# EAGLE design telemetry-board (EAGLE 8.5.0)

## Sheet 1 of 2
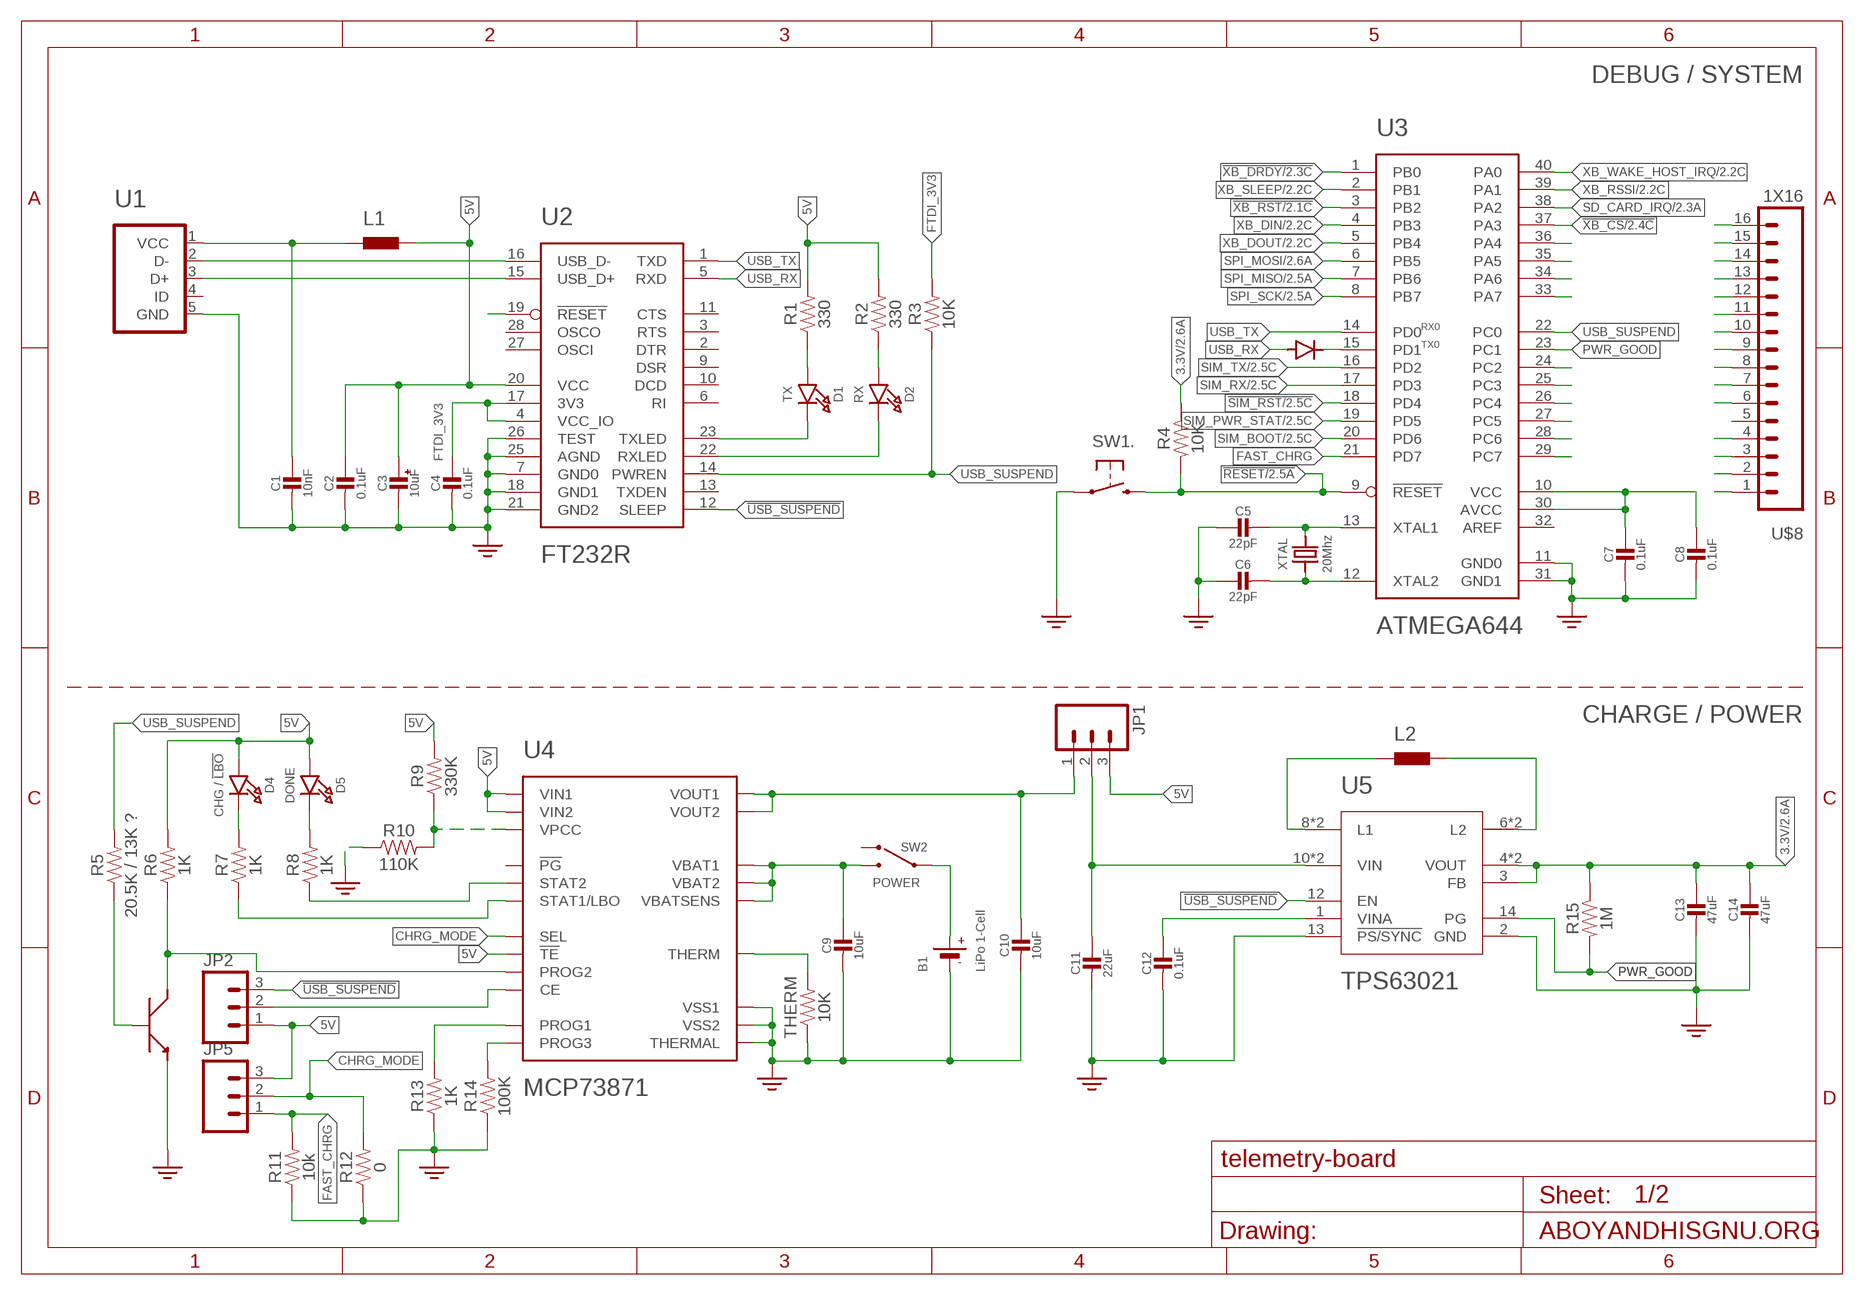
[diagram p0: schematic, sheet 1]
U$1 (FRAME_A4): AUTHOR: Harlan J. Waldrop

### Parts
B1  LiPo 1-Cell  BATTERY  [JSTPH2]
C1  10nF  CAPACITOR  [0805]
C2  0.1uF  CAPACITOR  [0805]
C3  10uF  CAPACITOR-POLAR  [0805]
C4  0.1uF  CAPACITOR  [0805]
C5  22pF  CAPACITOR  [0805]
C6  22pF  CAPACITOR  [0805]
C7  0.1uF  CAPACITOR  [0805]
C8  0.1uF  CAPACITOR  [0805]
C9  10uF  CAPACITOR  [0805]
C10  10uF  CAPACITOR  [0805]
C11  22uF  CAPACITOR  [0805]
C12  0.1uF  CAPACITOR  [0805]
C13  47uF  CAPACITOR  [0805]
C14  47uF  CAPACITOR  [0805]
D1  TX  LED0805_NOOUTLINE  [CHIPLED_0805_NOOUTLINE]
D2  RX  LED0805_NOOUTLINE  [CHIPLED_0805_NOOUTLINE]
D3  DIODE  [DB2J309]
D4  CHG / !LBO  LED0805_NOOUTLINE  [CHIPLED_0805_NOOUTLINE]
D5  DONE  LED0805_NOOUTLINE  [CHIPLED_0805_NOOUTLINE]
JP1  M03PTH  [1X03]
JP2  M03PTH  [1X03]
JP5  M03PTH  [1X03]
L1  INDUCTOR  [0805]
L2  INDUCTOR-744062001  [2727]
R1  330  RESISTOR  [0805]
R2  330  RESISTOR  [0805]
R3  10K  RESISTOR  [0805]
R4  10K  RESISTOR  [0805]
R5  20.5K / 13K ?  RESISTOR  [0805]
R6  1K  RESISTOR  [0805]
R7  1K  RESISTOR  [0805]
R8  1K  RESISTOR  [0805]
R9  330K  RESISTOR  [0805]
R10  110K  RESISTOR  [0805]
R11  10k  RESISTOR  [0805]
R12  0  RESISTOR  [0805]
R13  1K  RESISTOR  [0805]
R14  100K  RESISTOR  [0805]
R15  1M  RESISTOR  [0805]
SW1  SWITCH-B3U-1110-BOSS  [SWITCH-TACT-B3U-1100P-B]
SW2  POWER  SWITCH  [1101M2S4AQE2]
THERM  10K  RESISTOR  [0805]
U1  USB-RECEPTACLE  [USB-MICRO-B]
U2  FT232R  [SSOP-28]
U3  ATMEGA644  [DIP-2X20]
U4  MCP73871  [QFN20_4MM]
U5  TPS63021  [VSON-14-4X3]
U$2  TRANSISTOR  [SOT-223]
U$8  1X16  [1X16]
XTAL  20Mhz  CRYSTAL  [ABM3]

### Nets
3.3V: C7.1 C8.1 C13.1 C14.1 R4.1 R15.1 U3.10(VCC) U3.30(AVCC) U5.3(FB) U5.4(VOUT) U5.5(VOUT) U$8.7 ; also sheet 2
5V: C2.1 C3.1 D4.A D5.A JP1.3 JP2.1 JP5.3 L1.2 R1.2 R2.2 R6.2 R9.2 U2.20(VCC) U4.P$9(!TE) U4.P$18(VIN1) U4.P$19(VIN2)
!FT_RESET: U2.19(!RESET)
!RESET: R4.2 SW1.2 U3.9(!RESET) ; also sheet 2
!SIM_RST: U3.18(PD4) ; also sheet 2
!USB_SUSPEND: JP2.3 U2.12(SLEEP) U5.12(EN)
!XB_CS: U3.37(PA3) ; also sheet 2
!XB_DRDY: U3.1(PB0) ; also sheet 2
!XB_RST: U3.3(PB2) ; also sheet 2
_USB_RX: D3.- U3.15(PD1)
BASE: R5.1 U$2.B
CE: JP2.2 U4.P$17(CE)
CHRG_MODE: JP5.2 R12.2 U4.P$3(SEL)
FAST_CHRG: JP5.1 R11.2 U3.21(PD7) U$8.16
FROM_D3: D4.C R7.2
FROM_D4: D5.C R8.2
FTDI_3V3: C4.1 R3.2 U2.4(VCC_IO) U2.17(3V3)
GND: B1.1(-) C1.2 C2.2 C3.2 C4.2 C5.1 C6.1 C7.2 C8.2 C9.2 C10.2 C11.2 C12.2 C13.2 C14.2 R10.1 R11.1 R12.1 R13.1 R14.1 SW1.1 THERM.1 U1.5(GND) U2.7(GND0) U2.18(GND1) U2.21(GND2) U2.25(AGND) U2.26(TEST) U3.11(GND0) U3.31(GND1) U4.P$10(VSS1) U4.P$11(VSS2) U4.P$21(THERMAL) U5.2(GND) U5.13(!PS/SYNC) U$2.E U$8.6 ; also sheet 2
N$21: C12.1 U5.1(VINA)
PA4: U3.36(PA4) U$8.1
PA5: U3.35(PA5) U$8.2
PA6: U3.34(PA6) U$8.3
PA7: U3.33(PA7) U$8.4
PC2: U3.24(PC2) U$8.13
PC3: U3.25(PC3) U$8.12
PC4: U3.26(PC4) U$8.11
PC5: U3.27(PC5) U$8.10
PC6: U3.28(PC6) U$8.9
PC7: U3.29(PC7) U$8.8
PROG1: R13.2 U4.P$13(PROG1)
PROG2: R6.1 U4.P$4(PROG2) U$2.C0(C) U$2.C1(C)
PROG3: R14.2 U4.P$12(PROG3)
PWR_GOOD: R15.2 U3.23(PC1) U5.14(PG) U$8.14
RXLED: D2.C U2.22(RXLED)
SD_CARD_IRQ: U3.38(PA2) ; also sheet 2
SIM_BOOT: U3.20(PD6) ; also sheet 2
SIM_PWR_STAT: U3.19(PD5) ; also sheet 2
SIM_RX: U3.17(PD3) ; also sheet 2
SIM_TX: U3.16(PD2) ; also sheet 2
SPI_MISO: U3.7(PB6) ; also sheet 2
SPI_MOSI: U3.6(PB5) ; also sheet 2
SPI_SCK: U3.8(PB7) ; also sheet 2
STAT1: R7.1 U4.P$8(STAT1/LBO)
STAT2: R8.1 U4.P$7(STAT2)
SYS_BAT: C10.1 JP1.1 U4.P$1(VOUT1) U4.P$20(VOUT2)
THERM: THERM.2 U4.P$5(THERM)
TO_BAT: B1.2(+) SW2.1P
TO_D1: D1.A R1.1
TO_D2: D2.A R2.1
TO_L1: L2.P$1 U5.8(L1) U5.9(L1)
TO_L2: L2.P$2 U5.6(L2) U5.7(L2)
TPS_VIN: C11.1 JP1.2 U5.10(VIN) U5.11(VIN)
TXLED: D1.C U2.23(TXLED)
USB_5V: C1.1 L1.1 U1.1(VCC)
USB_D+: U1.3(D+) U2.15(USB_D+)
USB_D-: U1.2(D-) U2.16(USB_D-)
USB_RX: D3.+ U2.5(RXD)
USB_SUSPEND: R3.1 R5.2 U2.14(PWREN) U3.22(PC0) U$8.15
USB_TX: U2.1(TXD) U3.14(PD0)
VBAT: C9.1 SW2.2T U4.P$14(VBAT1) U4.P$15(VBAT2) U4.P$16(VBATSENS)
VPCC: R9.1 R10.2 U4.P$2(VPCC)
XB_DIN: U3.4(PB3) ; also sheet 2
XB_DOUT: U3.5(PB4) ; also sheet 2
XB_RSSI: U3.39(PA1) ; also sheet 2
XB_SLEEP: U3.2(PB1) ; also sheet 2
XB_WAKE_HOST_IRQ: U3.40(PA0) ; also sheet 2
XTAL1: C5.2 U3.13(XTAL1) XTAL.2
XTAL2: C6.2 U3.12(XTAL2) XTAL.1
Unconnected: SW1.BOSS SW2.1T U1.4(ID) U4.P$6(!PG) U$8.5

### Notes on the sheet
- DEBUG / SYSTEM
- RX0
- TX0
- CHARGE / POWER

## Sheet 2 of 2
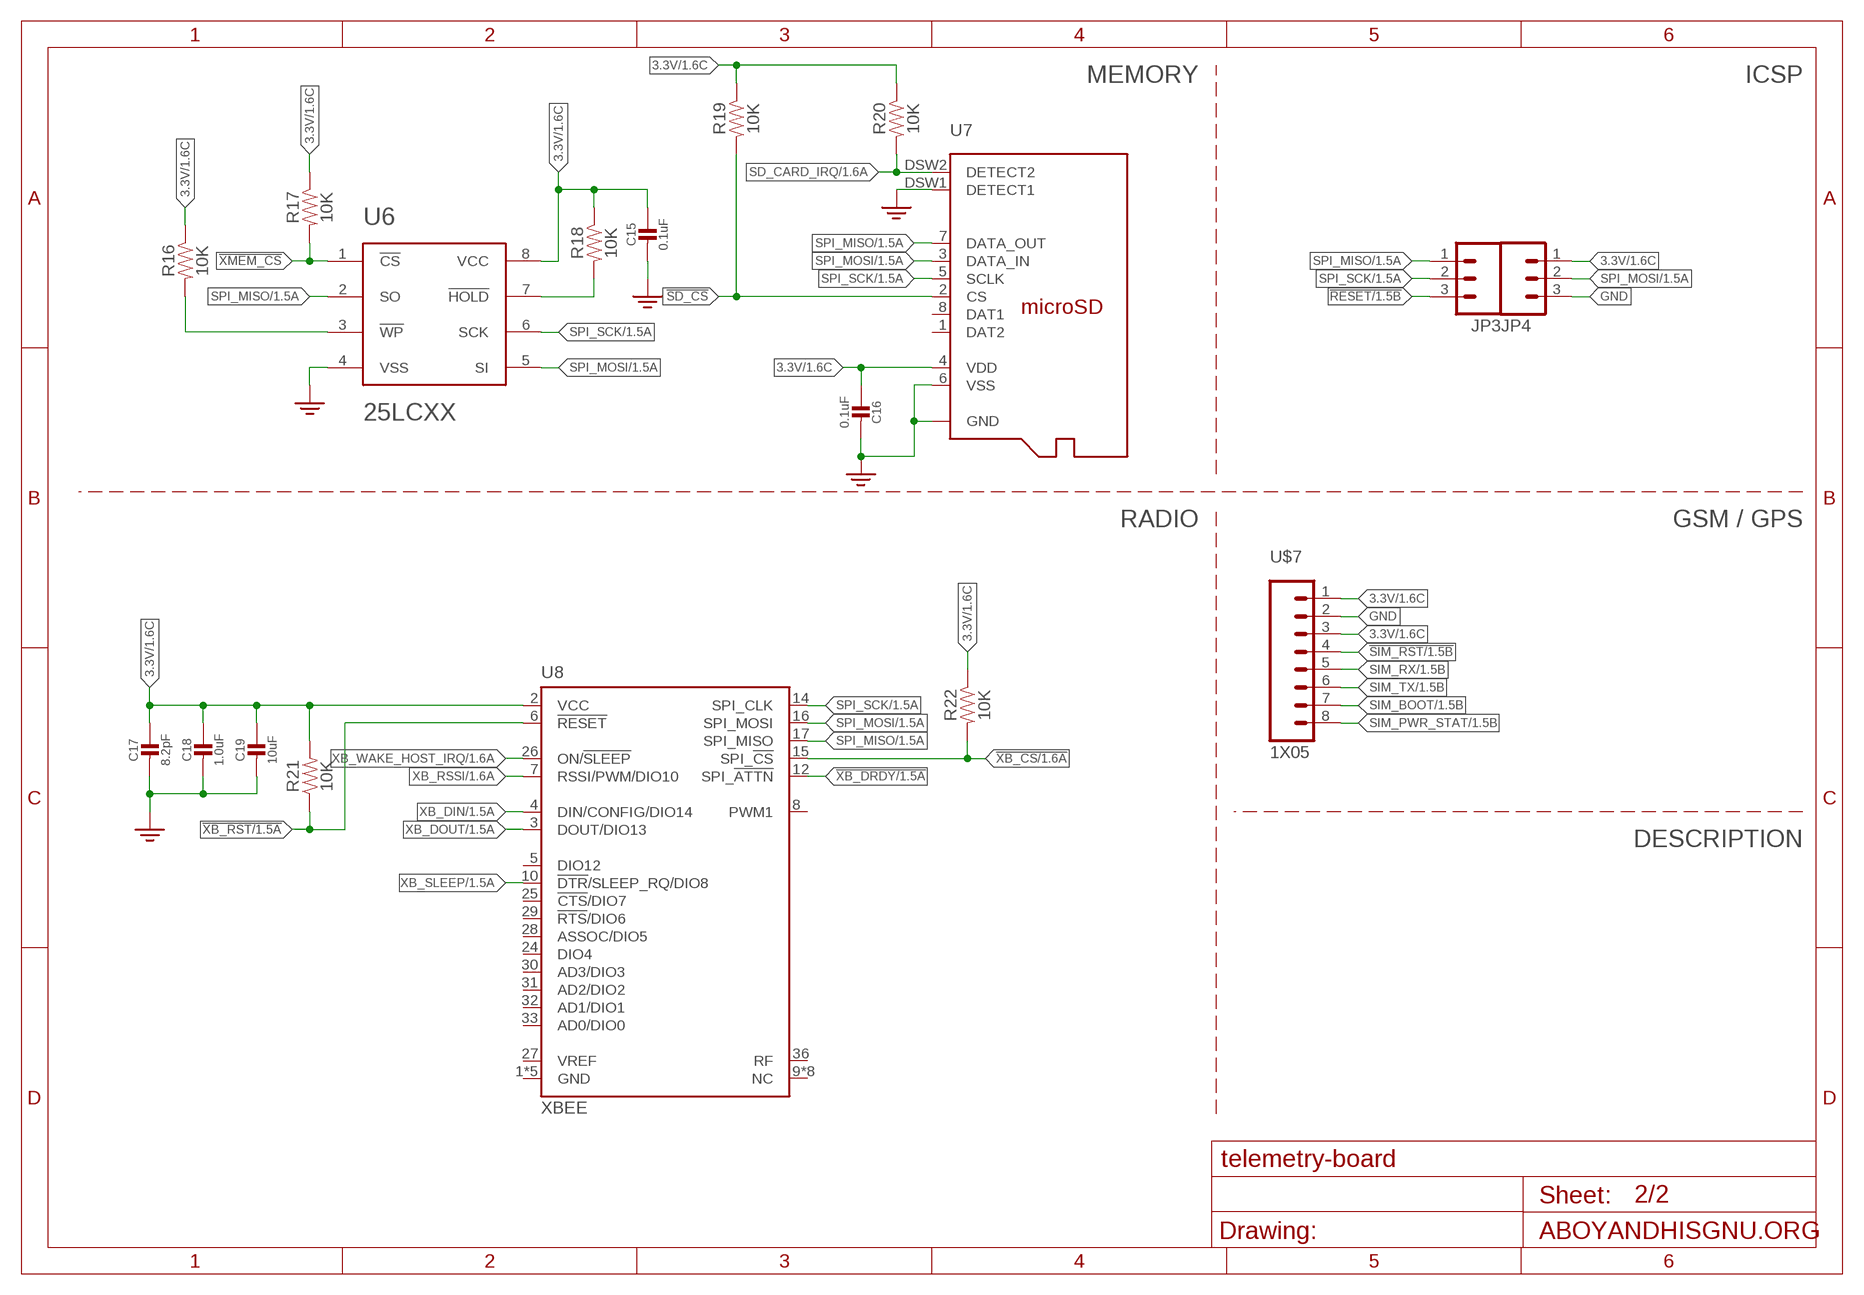
[diagram p1: schematic, sheet 2]
U$4 (FRAME_A4): AUTHOR: Harlan J. Waldrop

### Parts
C15  0.1uF  CAPACITOR  [0805]
C16  0.1uF  CAPACITOR  [0805]
C17  8.2pF  CAPACITOR  [0805]
C18  1.0uF  CAPACITOR  [0805]
C19  10uF  CAPACITOR  [0805]
JP3  M031X03_NO_SILK  [1X03_NO_SILK]
JP4  M031X03_NO_SILK  [1X03_NO_SILK]
R16  10K  RESISTOR  [0805]
R17  10K  RESISTOR  [0805]
R18  10K  RESISTOR  [0805]
R19  10K  RESISTOR  [0805]
R20  10K  RESISTOR  [0805]
R21  10K  RESISTOR  [0805]
R22  10K  RESISTOR  [0805]
U6  25LCXX  [DIP-2X4]
U7  MICROSD  [MICROSD]
U8  XBEE  [XBEE-S2C-SMNT]
U$7  1X05  [DIP-1X5]

### Nets
3.3V: C15.1 C16.1 C17.1 C18.1 C19.1 JP4.1 R16.1 R17.1 R18.1 R19.1 R20.1 R21.2 R22.1 U6.8(VCC) U7.4(VDD) U8.2(VCC) U$7.1 U$7.3 ; also sheet 1
!RESET: JP3.3 ; also sheet 1
!SD_CS: R19.2 U7.2(CS)
!SIM_RST: U$7.4 ; also sheet 1
!XB_CS: R22.2 U8.15(SPI_!CS) ; also sheet 1
!XB_DRDY: U8.12(SPI_!ATTN) ; also sheet 1
!XB_RST: R21.1 U8.6(!RESET) ; also sheet 1
!XMEM_CS: R17.2 U6.1(!CS)
!XMEM_HOLD: R18.2 U6.7(!HOLD)
!XMEM_WP: R16.2 U6.3(!WP)
GND: C15.2 C16.2 C17.2 C18.2 C19.2 JP4.3 U6.4(VSS) U7.6(VSS) U7.DSW1(DETECT1) U7.GND1(GND) U7.GND2(GND) U7.GND3(GND) U7.GND4(GND) U7.GND5(GND) U7.GND6(GND) U7.GND7(GND) U$7.2 ; also sheet 1
SD_CARD_IRQ: R20.2 U7.DSW2(DETECT2) ; also sheet 1
SIM_BOOT: U$7.7 ; also sheet 1
SIM_PWR_STAT: U$7.8 ; also sheet 1
SIM_RX: U$7.5 ; also sheet 1
SIM_TX: U$7.6 ; also sheet 1
SPI_MISO: JP3.1 U6.2(SO) U7.7(DATA_OUT) U8.17(SPI_MISO) ; also sheet 1
SPI_MOSI: JP4.2 U6.5(SI) U7.3(DATA_IN) U8.16(SPI_MOSI) ; also sheet 1
SPI_SCK: JP3.2 U6.6(SCK) U7.5(SCLK) U8.14(SPI_CLK) ; also sheet 1
XB_DIN: U8.4(DIN/CONFIG/DIO14) ; also sheet 1
XB_DOUT: U8.3(DOUT/DIO13) ; also sheet 1
XB_RSSI: U8.7(RSSI/PWM/DIO10) ; also sheet 1
XB_SLEEP: U8.10(!DTR!/SLEEP_RQ/DIO8) ; also sheet 1
XB_WAKE_HOST_IRQ: U8.26(ON/!SLEEP) ; also sheet 1
Unconnected: U7.1(DAT2) U7.8(DAT1) U8.5(DIO12) U8.8(PWM1) U8.9(NC) U8.18(NC) U8.19(NC) U8.20(NC) U8.21(NC) U8.23(NC) U8.24(DIO4) U8.25(!CTS!/DIO7) U8.27(VREF) U8.28(ASSOC/DIO5) U8.29(!RTS!/DIO6) U8.30(AD3/DIO3) U8.31(AD2/DIO2) U8.32(AD1/DIO1) U8.33(AD0/DIO0) U8.34(NC) U8.36(RF) U8.37(NC)

### Notes on the sheet
- MEMORY | ICSP
- RADIO | GSM / GPS
- DESCRIPTION

## Power pins joined to a net without a drawn wire
AREF: U3.32(AREF)
CTS: U2.11(CTS)
DCD: U2.10(DCD)
DSR: U2.9(DSR)
DTR: U2.2(DTR)
GND: U8.1(GND) U8.11(GND) U8.13(GND) U8.22(GND) U8.35(GND)
OSCI: U2.27(OSCI)
OSCO: U2.28(OSCO)
RI: U2.6(RI)
RTS: U2.3(RTS)
TXDEN: U2.13(TXDEN)

## Library data of the parts
B1 = telemetry-board:BATTERY: CR1220 SMT - Digikey: 3001K-ND CD2032 BAT-HLD-001 - Digikey: BAT-HLD-001-ND
C1 C2 C4-C19 = telemetry-board:CAPACITOR
C3 = telemetry-board:CAPACITOR-POLAR
D1 D2 D4 D5 = telemetry-board:LED: LED 0603 - 0603 Surface Mount Package 2mA: Green LED - Low Power (3.9mcd, 2ma, 1.7Vf) - Digikey: 475-2709-2-ND Orange LED - Low Power (9.8mcd, 2ma, 1.8Vf) - Digikey: 475-1194-2-ND Red LED - Low Power (5mcd, 2ma, 1.8Vf) - Digikey: 475-1195-2-ND Yellow LED - Low Power (7mcd, 2ma, 1.8Vf) - Digikey: 475-1196-2-ND 5mA: Blue LED - Low Power (17mcd, 5ma, 2.9Vf) - Digikey: LNJ937W8CRACT-ND 0805 - 0805 Surface Mount Package 2mA: Red LED (8.8mcd, 2mA, 1.8Vf, Clear) - Low Power [Digikey: 475-2510-1-ND] Green LED (5mcd, 2mA, 1.8Vf, Clear) - Low Power [Digikey: 475-2730-1-ND] Yellow LED (11.3mcd, 2mA, 1.8Vf, Clear) - Low Power [Digikey: 475-2555-1-ND] 20mA: Red LED (104mcd, 20mA, Diffused) - LS R976 [Digikey: 475-1278-6-ND] Red LED (12mcd, 20mA, 2.0Vf, Clear) - APT2012EC [Digikey: 754-1128-1-ND] Green LED (15mcd, 20mA, 2.2Vf, Clear) - APT2012GC [Digikey: 754-1131-1-ND] Orange LED (160mcd, 20mA, 2.1Vf, Clear) - APT2012SECK [Digikey: 754-1130-1-ND] 1206 - 1206 Surface Mount Package Green LED (26mcd, 20mA, Diffused) - LG N971 [Digikey: 475-1407-6-ND] Red LED (15mcd, 20mA, Diffused) - LH N974 [Digikey: 475-1416-6-ND] Cree - Cree High-Power Surface Mount LEDs XPEBWT-L1-0000-00D50 - White 111lm 350mA 2.9Vf 6200K 110° XTEAWT-00-0000-00000LEE3 - White 114lm 350mA 2.85Vf 5000K 115° Everlight - Everlight 45-21 Series Surface Mount LEDs 45-21/QK2C-B2832AC2CB2/2T - Warm White 2000mcd 20mA 3.25Vf 3050K 120° 45-21/LK2C-B38452C4CB2/2T - Nuetral White 2000mcd 20mA 3.25Vf 4150K 120° 45-21/LK2C-B50634C6CB2/2T - Cold White 2200mcd 20mA 3.25Vf 5650K 120° PLCC2 Reverse Mount LS T77K-J1L2-1-0-2-R18-Z - Red 11.25mcd 2mA 1.8Vf 630nm 120° LO T77K-L1M2-24-Z - Orange 19.6mcd 2mA 1.8Vf 606nm 120° LY T77K-K2M1-26-Z - Yellow 15.7mcd 2mA 1.8Vf 587nm 120°
D3 = telemetry-board:DIODE
JP1-JP5 = SparkFun-Connectors:M03: Header 3 Standard 3-pin 0.1" header. Use with straight break away headers (SKU : PRT-00116), right angle break away headers (PRT-00553), swiss pins (PRT-00743), machine pins (PRT-00117), and female headers (PRT-00115). Molex polarized connector foot print use with SKU : PRT-08232 with associated crimp pins and housings.
L1 L2 = telemetry-board:INDUCTOR
R1-R22 THERM = telemetry-board:RESISTOR
SW1 = stm32f4stamp:SWITCH-B3U-1110
SW2 = telemetry-board:SWITCH
U1 = telemetry-board:USB-RECEPTACLE
U2 = telemetry-board:FT232R
U3 = telemetry-board:ATMEGA644
U4 = telemetry-board:MCP73871: MCP73871 Lithium Polymer Battery Charger Digikey: MCP73871-2CCI/ML-ND
U5 = telemetry-board:TPS63021
U6 = telemetry-board:25LCXX
U7 = microsd:MICROSD: Micro-SD / Transflash card holder with SPI pinout For the 3M # 2908-05WB-MG and/or 4UCON #19656 push-push type; SPICEPREFIX: X
U8 = telemetry-board:XBEE
U$2 = harlan:TRANSISTOR
U$7 = telemetry-board:1X05
U$8 = telemetry-board:1X16
XTAL = telemetry-board:CRYSTAL

## Board
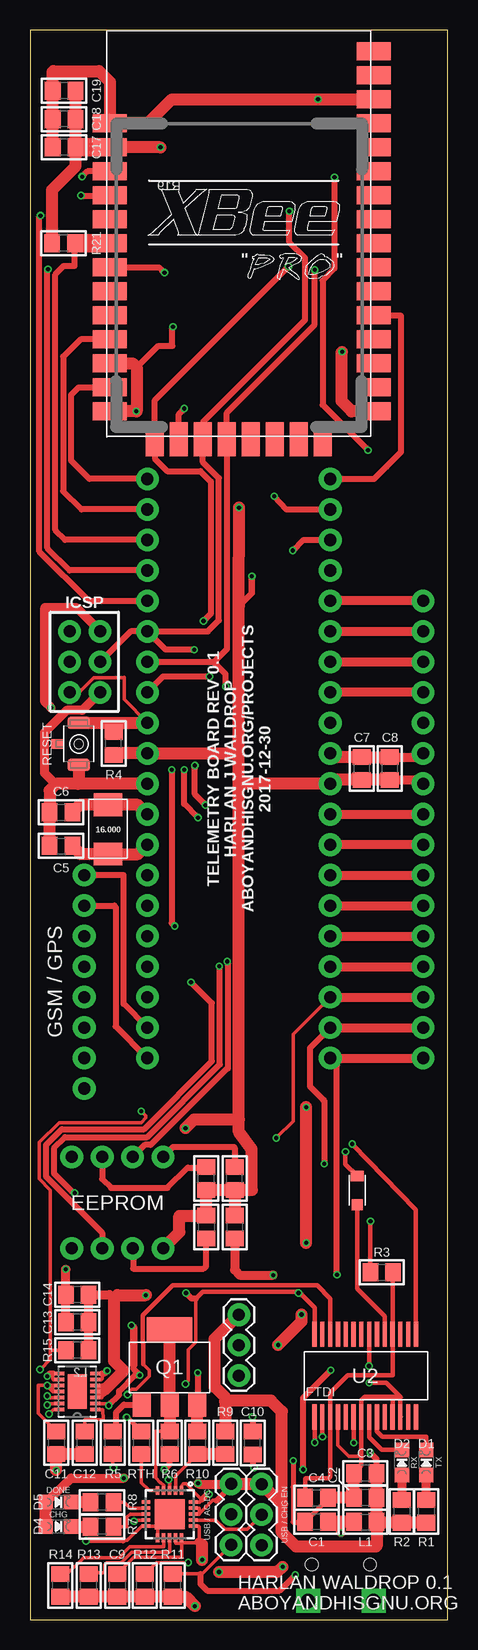
[diagram p2: board, top side]
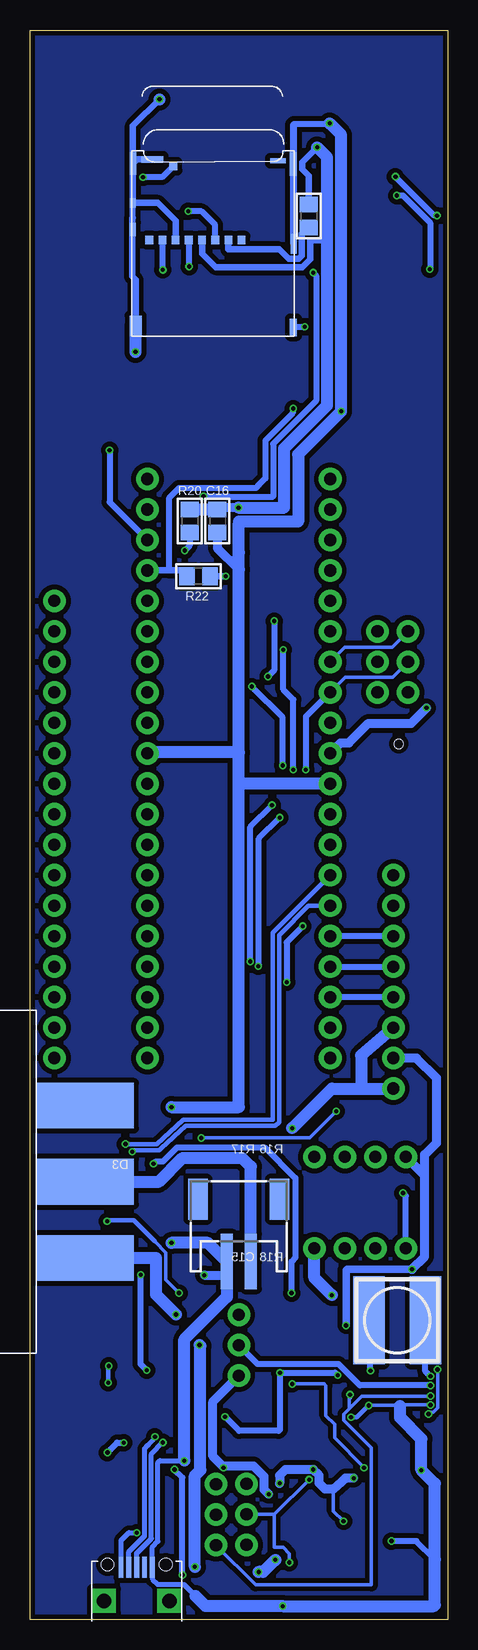
[diagram p3: board, bottom side, seen from below]

Size 34.8 x 132.46 mm. Coordinates in mm from the lower left corner, seen from the top.
Outline: 34.8,0 34.8,132.46 0,132.46 0,0 34.8,0
Copper layers (1*16): Top 0.035559375mm / dielectric 1.6mm / Bottom 0.035559375mm
Design rules "oshpark-2layer": minimum track width 6mil, minimum drill 10mil, track to track 6mil, track to pad 6mil, pad to pad 6mil, via to via 6mil, smd to smd 6mil, copper to edge 15mil, drill to drill 6mil, minimum pad ring 5mil, minimum via ring 5mil, stop-mask expansion 2.5mil, vias tented up to drill 0mil, thermal gap 10mil

### Footprints (pad centres in the part's own frame; a part is rotated, then mirrored left to right if it is on the bottom)
JSTPH2 = smd 1 x 4.6: 1 -1,-3.7; 2 1,-3.7 | smd 1.6 x 3.4: NC1 -3.4,1.5; NC2 3.4,1.5
0805 = smd 1.3 x 1.5: 1 -0.95,0; 2 0.95,0
CHIPLED_0805_NOOUTLINE = smd 1.2 x 1.2: A 0,-1.05; C 0,1.05
DB2J309 = smd 0.9 x 0.9: + 0,1.2 | smd 1.1 x 0.9: - 0,-1.2
1X03 = drill 1.016 pad 1.88: 1 0,0; 2 2.54,0; 3 5.08,0
1X03_NO_SILK = drill 1.016 pad 1.88: 1 0,0; 2 2.54,0; 3 5.08,0
2727 = smd 7.3 x 2.6: P$1 0,2.35; P$2 0,-2.35
SWITCH-TACT-B3U-1100P-B = smd 1 x 1.9: 1 -1.75,0; 2 1.75,0 | smd 0.8 x 1.1: BOSS 0,1.75 | hole 0.762: 0,0
1101M2S4AQE2 = smd 3.81 x 8.128: 1P 0,4.064; 1T -6.35,4.064; 2T 6.35,4.064
USB-MICRO-B = smd 0.4 x 1.75: 1 -1.3,0.185; 2 -0.65,0.185; 3 0,0.185; 4 0.65,0.185; 5 1.3,0.185 | drill 1.2 pad 2 square: P$3 -2.725,-2.64; P$4 2.725,-2.64 | hole 1.05: -2.425,0.39; 2.425,0.39
SSOP-28 = smd 2.1 x 0.35: 1 -3.45,4.225; 2 -3.45,3.575; 3 -3.45,2.925; 4 -3.45,2.275; 5 -3.45,1.625; 6 -3.45,0.975; 7 -3.45,0.325; 8 -3.45,-0.325; 9 -3.45,-0.975; 10 -3.45,-1.625; 11 -3.45,-2.275; 12 -3.45,-2.925; 13 -3.45,-3.575; 14 -3.45,-4.225; 15 3.45,-4.225; 16 3.45,-3.575; 17 3.45,-2.925; 18 3.45,-2.275; 19 3.45,-1.625; 20 3.45,-0.975; 21 3.45,-0.325; 22 3.45,0.325; 23 3.45,0.975; 24 3.45,1.625; 25 3.45,2.275; 26 3.45,2.925; 27 3.45,3.575; 28 3.45,4.225
DIP-2X20 = drill 1.016 pad 1.88: 1 -7.62,24.13; 2 -7.62,21.59; 3 -7.62,19.05; 4 -7.62,16.51; 5 -7.62,13.97; 6 -7.62,11.43; 7 -7.62,8.89; 8 -7.62,6.35; 9 -7.62,3.81; 10 -7.62,1.27; 11 -7.62,-1.27; 12 -7.62,-3.81; 13 -7.62,-6.35; 14 -7.62,-8.89; 15 -7.62,-11.43; 16 -7.62,-13.97; 17 -7.62,-16.51; 18 -7.62,-19.05; 19 -7.62,-21.59; 20 -7.62,-24.13; 21 7.62,-24.13; 22 7.62,-21.59; 23 7.62,-19.05; 24 7.62,-16.51; 25 7.62,-13.97; 26 7.62,-11.43; 27 7.62,-8.89; 28 7.62,-6.35; 29 7.62,-3.81; 30 7.62,-1.27; 31 7.62,1.27; 32 7.62,3.81; 33 7.62,6.35; 34 7.62,8.89; 35 7.62,11.43; 36 7.62,13.97; 37 7.62,16.51; 38 7.62,19.05; 39 7.62,21.59; 40 7.62,24.13
QFN20_4MM = smd 0.73 x 0.28: P$1 -1.965,1; P$2 -1.965,0.5; P$3 -1.965,0; P$4 -1.965,-0.5; P$5 -1.965,-1; P$11 1.965,-1; P$12 1.965,-0.5; P$13 1.965,0; P$14 1.965,0.5; P$15 1.965,1 | smd 0.28 x 0.73: P$6 -1,-1.965; P$7 -0.5,-1.965; P$8 0,-1.965; P$9 0.5,-1.965; P$10 1,-1.965; P$16 1,1.965; P$17 0.5,1.965; P$18 0,1.965; P$19 -0.5,1.965; P$20 -1,1.965 | smd 2.5 x 2.5: P$21 0,0
VSON-14-4X3 = smd 0.82 x 0.28: 1 -1.51,1.5; 2 -1.51,1; 3 -1.51,0.5; 4 -1.51,0; 5 -1.51,-0.5; 6 -1.51,-1; 7 -1.51,-1.5; 8 1.51,-1.5; 9 1.51,-1; 10 1.51,-0.5; 11 1.51,0; 12 1.51,0.5; 13 1.51,1; 14 1.51,1.5 | smd 1.58 x 2.85: 15 0,0
DIP-2X4 = drill 1.016 pad 1.88: 1 -3.81,3.81; 2 -3.81,1.27; 3 -3.81,-1.27; 4 -3.81,-3.81; 5 3.81,-3.81; 6 3.81,-1.27; 7 3.81,1.27; 8 3.81,3.81
MICROSD = smd 0.64 x 0.7: 1 2.37,8; 2 1.27,8; 3 0.17,8; 4 -0.93,8; 5 -2.03,8; 6 -3.13,8; 7 -4.23,8; 8 -5.33,8 | smd 1.85 x 0.55: DSW1 -5.075,14.725 | smd 0.7 x 0.7: DSW2 -3.33,14.15 | smd 0.57 x 1.45: GND1 6.685,0.725 | smd 0.52 x 1.65: GND2 6.71,7.68 | smd 0.57 x 1.96: GND3 6.685,14.32 | smd 0.57 x 1.85: GND4 -6.685,14.375 | smd 0.52 x 0.82: GND5 -6.71,11.09 | smd 0.52 x 1.15: GND6 -6.71,8.88 | smd 1.01 x 1.7: GND7 -6.465,0.85 | smd 1.3 x 0.45: HOLD-DOWN 5.4,14.605
XBEE-S2C-SMNT = smd 2.84 x 1.52: 1 -10.745,26.08; 2 -10.745,24.08; 3 -10.745,22.08; 4 -10.745,20.08; 5 -10.745,18.08; 6 -10.745,16.08; 7 -10.745,14.08; 8 -10.745,12.08; 9 -10.745,10.08; 10 -10.745,8.08; 11 -10.745,6.08; 12 -10.745,4.08; 13 -10.745,2.08; 22 11.255,2.08; 23 11.255,4.08; 24 11.255,6.08; 25 11.255,8.08; 26 11.255,10.08; 27 11.255,12.08; 28 11.255,14.08; 29 11.255,16.08; 30 11.255,18.08; 31 11.255,20.08; 32 11.255,22.08; 33 11.255,24.08; 34 11.255,26.08; 35 11.255,28.08; 36 11.255,30.08; 37 11.255,32.08 | smd 1.52 x 2.84: 14 -7,-0.25; 15 -5,-0.25; 16 -3,-0.25; 17 -1,-0.25; 18 1,-0.25; 19 3,-0.25; 20 5,-0.25; 21 7,-0.25
SOT-223 = smd 1.5 x 2: B -2.3,0; C0 0,0; E 2.3,0 | smd 3.8 x 2: C1 0,6.3
DIP-1X5 = drill 1.016 pad 1.88: 1 0,10.16; 2 0,7.62; 3 0,5.08; 4 0,2.54; 5 0,0; 6 0,-2.54; 7 0,-5.08; 8 0,-7.62
1X16 = drill 1.016 pad 1.88: 1 0,19.05; 2 0,16.51; 3 0,13.97; 4 0,11.43; 5 0,8.89; 6 0,6.35; 7 0,3.81; 8 0,1.27; 9 0,-1.27; 10 0,-3.81; 11 0,-6.35; 12 0,-8.89; 13 0,-11.43; 14 0,-13.97; 15 0,-16.51; 16 0,-19.05
ABM3 = smd 1.9 x 2.4: 1 -2.05,0; 2 2.05,0

### Placement (x,y rotation side)
B1  17.4,33.53 0 bottom
C1  23.88,8.13 180 top
C2  27.94,10.16 180 top
C3  27.94,12.19 180 top
C4  23.88,10.16 0 top
C5  2.59,64.47 0 top
C6  2.59,67.28 0 top
C7  27.66,70.92 90 top
C8  30,70.92 90 top
C9  7.26,2.84 270 top
C10  18.54,14.71 90 top
C11  2.18,14.73 270 top
C12  4.55,14.73 270 top
C13  3.94,24.77 180 top
C14  3.94,27.08 180 top
C15  17.04,32.72 270 top
C16  19.18,91.54 270 bottom
C17  2.84,125.04 180 top
C18  2.84,122.68 180 top
C19  2.84,127.41 180 top
D1  33.02,13.08 0 top
D2  30.99,13.08 0 top
D3  27.28,35.76 180 top
D4  2.36,7.75 270 top
D5  2.36,9.78 270 top
JP1  17.4,20.32 90 top
JP2  19.3,11.28 270 top
JP3  3.3,82.35 270 top
JP4  5.84,82.35 270 top
JP5  16.76,6.22 90 top
L1  27.94,8.13 0 top
L2  4.19,24.94 270 bottom
R1  33.02,9.02 270 top
R2  30.99,9.02 270 top
R3  29.31,28.93 0 top
R4  6.96,73 90 top
R5  6.91,14.73 270 top
R6  11.63,14.73 270 top
R7  5.99,7.75 180 top
R8  5.99,9.78 180 top
R9  16.26,14.73 90 top
R10  13.94,14.73 270 top
R11  11.89,2.84 90 top
R12  9.58,2.84 90 top
R13  4.9,2.84 90 top
R14  2.54,2.84 90 top
R15  3.94,22.43 180 top
R16  14.68,36.75 90 top
R17  17.04,36.75 90 top
R18  14.68,32.72 270 top
R19  11.58,116.97 270 bottom
R20  21.49,91.54 270 bottom
R21  2.79,114.68 180 top
R22  20.75,86.94 180 bottom
SW1  4.06,72.97 90 top
SW2  34.26,36.47 270 bottom
THERM  9.27,14.73 270 top
U1  25.91,4.19 0 bottom
U2  27.94,20.32 270 top
U3  17.4,70.92 0 top
U4  11.63,8.79 270 top
U5  3.94,19 180 top
U6  7.29,34.75 270 top
U7  19.53,106.96 0 bottom
U8  17.4,98.6 0 top
U$2  11.63,17.91 0 top
U$7  4.52,54.41 180 top
U$8  32.77,65.84 0 top
XTAL  6.5,65.84 270 top

### Tracks (layer width: path | path; a pad name or v marks a point on that pad's centre or on a via)
3.3V  (via drill 0.35)
  Top 0.279: U5.5 5.97,19.5 5.97,19 | 5.97,19 U5.4 | 5.97,19 5.97,18.5 U5.3
  Top 0.533: 17.41,84.45 18.49,85.53 v18.49,86.94
  Top 0.762: v1.75,75.97 1.25,76.48 1.25,84.33 1.27,84.35 3.83,84.35 JP4.1 | C18.1 4.37,122.68 | 4.89,24.82 4.91,24.84 | R15.1 C13.1 C14.1 6.63,27.08 6.99,26.72 | C8.1 32.45,69.97 U$8.7
  Top 1.016: R17.1 R16.1 R18.1 14.65,33.63 12.45,33.63 12.45,32.28 U6.8 | 4.91,24.84 C13.1 | v9.65,27.03 7.29,27.03 6.99,26.72 6.99,21.57 7.72,20.83 7.72,20.64 6.28,19.2 6.17,19.2 5.97,19 | 17.4,41.66 17.4,40.61 18.45,39.2 18.45,35.83 18.48,35.8 | 17.4,41.66 17.4,69.47 | 17.4,69.47 17.58,69.65 U3.30 25.34,69.97 C7.1 C8.1 30.02,69.99 | 17.4,69.47 17.4,72.14 | 17.4,72.14 9.83,72.14 U3.10 7.33,72.19 R4.1 | C18.1 C17.1 C19.1 | C18.1 | R21.2 1.84,119.14 3.81,121.11 3.81,122.67 C18.1 | 17.4,72.14 17.41,84.45 v17.42,92.66 | v10.87,122.68 U8.2 | R17.1 18.48,35.8 | 18.48,35.8 18.49,35.81 | 17.4,41.66 13.66,41.66 v12.95,40.95 | R17.1 C15.1
  Top 1.524: U8.2 4.37,122.68
  Bottom 0.533: R19.1 11.58,120.32 12.12,120.85 12.12,121.44 v10.87,122.68 | 10.03,115.29 10.32,115.29 10.66,114.95 11.45,114.95 11.45,113.36 12.11,112.71 19.32,112.71 19.33,112.7 20.46,113.83 U7.4 | v18.49,86.94 R22.1
  Bottom 0.66: 10.92,122.63 v10.87,122.68
  Bottom 0.762: v1.75,75.97 3.05,74.68 6.6,74.68 8.23,73.05 8.91,73.05 U3.10 | v17.42,92.66 19.09,92.66 C16.1
  Bottom 1.016: v10.87,122.68 10.03,121.84 10.03,115.29 10.03,101.17 13.61,97.59 13.61,92.66 v17.42,92.66 | C16.1 R20.1 | v9.65,27.03 11.1,28.47 U6.8 | v12.95,40.95 9.65,44.25 7.21,44.25 | 7.21,44.25 U$7.1 4.39,44.25 | U$7.3 7.21,47.02 7.21,44.25
5V  (via drill 0.35)
  Top 0.279: U4.P$19 14.11,9.29 14.11,8.8 | U4.P$18 14.1,8.79 14.11,8.8 | 14.11,8.8 15.24,9.93 15.54,9.93 | U4.P$9 8.77,8.29 v8.67,8.19
  Top 0.356: U2.20 26.96,14.75 v26.98,14.73
  Top 0.508: C3.1 28.89,13.38 v28.35,13.92 | 16.71,11.28 16.79,11.28 16.79,11.18 15.54,9.93 | v11.19,12.49 11.63,12.94 R6.2
  Top 0.762: D5.A 3.42,11.79 v7.82,11.79 | v13.99,11.35 14.07,11.28 16.79,11.28
  Top 1.016: C3.1 C2.1 L1.2 | R1.2 R2.2 28.95,8.07 L1.2 | D4.A D5.A | JP5.3 16.79,11.28 JP2.1 20.98,9.6 | L1.2 28.89,6.13 28.83,6.07 22.17,6.07 20.98,7.26 20.98,9.6 | 20.98,9.6 20.98,17.32 20.07,18.24 16.31,18.24 | 16.31,18.24 16.26,18.19 R9.2 | 16.31,18.24 16.31,18.47 15.39,19.38 15.39,23.39 JP1.3
  Bottom 0.279: v8.67,8.19 9.52,9.04 9.52,10.87
  Bottom 0.508: v28.35,13.92 27.53,14.73 v26.98,14.73
  Bottom 0.762: v7.82,11.79 8.51,11.79 9.52,10.87 10.21,10.87 10.7,11.37 10.7,12.01 v11.19,12.49 13.52,12.49 13.99,12.01 v13.99,11.35
!RESET
  Top 0.279: JP3.3 4.1,77.27 5.33,78.5 7.84,78.5 | 7.84,78.5 7.85,78.51 | U3.9 7.84,76.67 7.84,77.67 7.84,78.5
  Top 1.016: SW1.2 6.99,74.72 | 6.99,74.72 U3.9 | R4.2 7.19,74.52 6.99,74.72
!SD_CS
  Bottom 0.533: R19.2 12.14,115.46 12.14,113.65 12.39,113.39 13.26,113.39 14.03,114.17 18.26,114.17 U7.2
!SIM_RST
  Bottom 0.508: U$7.4 U3.18
!USB_SUSPEND  (via drill 0.35)
  Top 0.279: U5.12 1.56,18.5 v1.43,18.64 | 9.44,21.28 9.93,20.79 9.93,20.29 8.84,19.2 8.46,19.2 8.29,19.03 8.29,18.91 v8.13,18.74 | 25.04,23.8 U2.12
  Top 0.356: 9.44,21.28 9.44,23.03 9.4,23.07 9.4,25.34 11.9,27.84 23.93,27.84 25.02,26.75 U2.12
  Bottom 0.279: v1.43,18.64 1.46,18.61 7.15,18.61 8.18,17.58 | 8.18,17.58 8.65,17.11 8.65,16.62 6.35,14.32 6.35,2.9 16,2.9 JP2.3 | 8.18,17.58 8.18,18.39 8.13,18.44 v8.13,18.74
!XB_CS  (via drill 0.35)
  Top 0.508: U8.15 12.4,100.46 v12.85,100.91
  Bottom 0.508: v12.85,100.91 12.9,100.86 12.9,100.53 15.19,98.24 15.19,95.1 15.72,94.56 15.95,94.34 15.98,94.31 22.38,94.31 23.19,93.5 23.19,87.43
  Bottom 0.533: R22.2 22.18,87.43 23.19,87.43 U3.37
!XB_DRDY
  Top 0.508: U3.1 4.95,95.05 3.43,96.57 3.43,102.06 4.05,102.68 U8.12
!XB_RST
  Top 0.508: U3.3 2.92,89.97 2.11,90.78 2.11,112.09 2.82,112.8 3.71,112.8 3.71,114.64 R21.1
  Top 0.762: R21.1 4.5,114.68
  Top 1.016: R21.1
  Top 1.524: U8.6 4.5,114.68
!XMEM_CS
  Top 0.508: R17.2 17.04,39.32 16.99,39.37 11.91,39.37 U6.1
!XMEM_HOLD
  Top 0.508: R18.2 14.68,29.44 14.48,29.23 8.59,29.23 8.59,30.35 U6.7
!XMEM_WP
  Top 0.508: U6.3 6.02,36.7 6.76,35.97 11.46,35.97 13.16,37.67 14.65,37.67 R16.2
_USB_RX  (via drill 0.35)
  Top 0.356: D3.- 26.29,37.96 v26.29,38.99
  Bottom 0.356: v26.29,38.99 26.16,39.12 24.23,39.12 24.03,39.11 24.02,39.12 24.01,39.12 23.87,39.26 21.82,41.15 17.14,41.15 14.34,41.15 14.05,41.45 14.05,57.04 11.6,59.49 U3.15
BASE
  Top 0.508: 7.18,15.95 7.18,17.27 7.82,17.91 U$2.B
  Top 0.762: R5.1 7.18,15.95
CE
  Top 0.279: U4.P$17 15.5,8.29 16.25,7.53 18.1,7.53 JP2.2
CHRG_MODE  (via drill 0.35)
  Top 0.279: R12.2 10.53,4.75 v13.18,4.75 | U4.P$3 11.63,11.57 v11.54,11.66
  Bottom 0.279: v11.54,11.66 14.44,8.76 | 14.44,8.76 JP5.2 | 14.44,6 14.44,8.76
  Bottom 0.305: v13.18,4.75 13.18,5.49 13.7,6 14.44,6
FAST_CHRG  (via drill 0.35)
  Top 0.279: R11.2 14.2,3.79 14.34,3.79 JP5.1
  Top 0.508: 14.2,3.79 14.2,2.97 14.76,2.41 20.8,2.41 v22.1,3.71 | v22.76,12.5 22.76,18.47 v25.07,20.78 | v25.58,28.73 25.58,46.23 U3.21
  Top 0.762: U3.21 U$8.16
  Bottom 0.508: v22.1,3.71 22.1,11.84 v22.76,12.5 | v25.07,20.78 25.58,21.29 v25.58,28.73
FROM_D3
  Top 1.016: D4.C R7.2
FROM_D4
  Top 1.016: R8.2 D5.C
FTDI_3V3
  Top 0.356: C4.1 22.93,11.75 22.96,11.79 24.89,11.79 25.02,11.91 U2.17 25.02,18.92 26.47,20.37 30.23,20.37 30.23,23.76 U2.4 30.21,28.88 R3.2
GND  (via drill 0.35)
  Top 0.279: U4.P$11 10.63,7.79 | U4.P$21 10.63,7.79 | 10.63,7.79 U4.P$10 9.31,7.79 8.12,6.59 7.76,6.59 | U5.13 1.55,18 v1.43,17.88 | U5.2 6.42,18 v6.57,17.84 | U2.18 25.66,14.52 26.57,13.61 27.61,13.61
  Top 0.356: C3.2 27.61,12.82 27.61,13.61 U2.21 27.61,18.29 27.89,18.57 30.25,18.57 | THERM.1 8.09,16.87 v8.05,16.87 | 30.25,18.57 30.86,18.57 | 30.86,18.56 30.89,18.54 | 30.89,16.89 U2.26 30.86,18.56 | U2.25 30.21,18.53 30.25,18.57 | 30.86,18.56 30.86,18.57 | 30.86,18.57 29.69,19.74 v28.27,19.74 | U2.7 28.27,21.15 v28.25,21.13
  Top 0.381: C1.2 24.83,10.03 C4.2
  Top 0.406: 22.91,8.11 22.9,8.1 21.95,8.1 21.92,8.13 | v21.94,13.23 21.94,11.08 21.92,11.06 21.92,8.13 | 21.92,8.13
  Top 0.508: 22.91,8.11 C1.2 | v4.67,6.54 4.72,6.59 7.76,6.59 | v13.97,20.57 13.97,17.92 13.95,17.9 | v18.54,16.89 C10.2 | v6.57,17.84 7.42,18.69 7.42,19.04 8.74,20.36 v9.16,20.36 8.66,20.85 8.66,23.01 | 8.89,104.34 10.69,106.15 11.86,106.15 11.86,107.67 v11.91,107.72
  Top 0.635: 8.66,21.22 8.66,23.01 8.66,24.31 v8.46,24.51
  Top 0.762: C15.2 17.04,29.13 17.48,28.7 v20.27,28.7 | JP4.3 4.34,75.77 3.05,75.77 1.22,73.94 1.22,70.54 2.11,69.65 2.74,69.65 | C13.2 C14.2 2.99,29.17 v2.97,29.18 | C8.2 32.45,71.87 U$8.6
  Top 1.016: C3.2 C2.2 C4.2 | R14.1 R13.1 C9.2 R12.1 R11.1 12.96,1.9 v13.74,1.12 | R10.1 13.95,17.9 U$2.E | C12.2 C11.2 v2.18,12.45 | v23.01,31.39 v23.01,42.7 | C5.1 C6.1 1.63,67.3 1.63,69.09 2.18,69.65 2.74,69.65 3.99,69.65 | U3.11 3.99,69.65 | SW1.1 4.06,69.72 3.99,69.65 | U3.31 25.34,71.87 C7.2 C8.2 | C18.2 C17.2 C19.2 1.9,128.97 1.96,129.03 5.77,129.03 6.65,128.14 U8.1 v9.83,124.69 11.82,126.68 v24,126.68 U8.35 | U8.13 v8.87,100.69 8.89,100.71 8.89,104.34 8.55,104.68 U8.11 | U8.22 26.8,100.68 25.96,101.52 25.96,105.59 v26.01,105.64
  Bottom 0.279: v1.43,17.88 3.89,17.88 3.92,17.84 | 3.96,17.8 3.92,17.84 | v6.57,17.84 3.92,17.84
  Bottom 0.356: v8.05,16.87 7.55,16.87 v6.57,17.84 | v28.27,19.74 28.27,21.11 v28.25,21.13
  Bottom 0.406: 20.6,1.55 21.01,1.96 21.97,2.92 24.16,2.92 24.61,3.37 U1.5 24.61,6.03 24.13,6.5 24.13,13.08 23.98,13.23 v21.94,13.23
  Bottom 0.508: 1.07,5 2.61,6.54 v4.67,6.54 | v18.54,16.89 17.37,15.72 14.07,15.72 13.97,15.82 v13.97,20.57 9.37,20.57 v9.16,20.36 | 12.85,114.66 U7.GND2 | v9.83,124.69 9.91,124.61 12.79,124.61 12.85,124.56 | U7.GND6 26.24,116.81 U7.GND5 | v11.91,107.72 11.95,107.68 U7.GND1
  Bottom 0.533: 26.24,116.81 26.29,116.77 26.29,111.94 26,111.65 U7.GND7 | U7.GND4 26.22,124.47 v24,126.69 | U7.6 22.66,116.57 24.15,118.05 U7.GND5
  Bottom 0.559: U7.GND5 26.24,121.31 U7.GND4 25.87,121.68 U7.DSW1
  Bottom 0.584: 12.85,114.66 U7.GND3 12.85,124.56
  Bottom 0.635: v8.46,24.51 8.46,29.11 8.36,29.21 3,29.21 v2.97,29.18
  Bottom 0.762: v20.27,28.7 18.48,28.7 18.4,28.78 | C16.2 19.18,89.28 17.4,87.5 | v2.97,29.18 1.91,30.25 1.91,36.98 | 1.91,36.98 U6.4 | 1.91,36.98 1.91,38.73 0.91,39.73 0.91,45.11 2.59,46.79 U$7.2
  Bottom 1.016: 21.01,1.96 20.17,1.12 v13.74,1.12 1.14,1.12 1.07,1.19 1.07,5 1.07,11.33 v2.18,12.45 2.18,15.06 3.96,16.84 3.96,17.8 | v21.94,13.23 21.94,23.34 18.4,26.89 | 18.4,26.89 18.39,26.9 | 18.4,26.89 18.4,28.78 B1.1 19.96,31.39 v23.01,31.39 | v23.01,42.7 17.4,42.7 17.4,69.65 | 17.4,69.65 17.35,69.7 | 17.4,69.65 17.4,72.26 | 17.4,72.26 24.94,72.26 U3.31 | U3.11 17.4,69.65 | 17.4,72.26 17.4,87.5 17.4,88.92 | 17.4,88.92 17.4,91.36 17.37,91.49 12.45,91.49 12.45,97.1 v8.87,100.69 8.87,123.72 v9.83,124.69 | v24,126.69 v24,126.68 | 17.42,88.9 17.4,88.92 | v26.01,105.64 26,105.65 U7.GND7
N$1
  pour Bottom (isolate 0.406): 0,0 0,132.46 34.8,132.46 34.8,0
N$21
  Top 0.279: U5.1 5.87,17.5 6.07,17.5 6.1,16.69 4.55,16.66 C12.1
PA4
  Top 0.762: U$8.1 U3.36
PA5
  Top 0.762: U3.35 U$8.2
PA6
  Top 0.762: U3.34 U$8.3
PA7
  Top 0.762: U$8.4 U3.33
PC2
  Top 0.762: U3.24 U$8.13
PC3
  Top 0.762: U3.25 U$8.12
PC4
  Top 0.762: U3.26 U$8.11
PC5
  Top 0.762: U3.27 U$8.10
PC6
  Top 0.762: U$8.9 U3.28
PC7
  Top 0.762: U3.29 U$8.8
PROG1
  Top 0.279: U4.P$13 11.63,5.64 11.61,5.61 8.47,5.61 7.6,4.74 6.39,4.74 6.22,4.57 6.22,4.04 6.07,3.89 4.99,3.89 R13.2
PROG2
  Top 0.279: U4.P$4 11.13,11.17 10.89,11.41 10.87,11.41 10.46,11.81 10.46,15.7 11.62,15.7 R6.1
  Top 1.016: R6.1 U$2.C0 U$2.C1
PROG3
  Top 0.279: U4.P$12 11.13,6.08 11.1,6.04 8.29,6.04 7.42,5.17 4.46,5.17 3.09,3.79 R14.2
PWR_GOOD  (via drill 0.35)
  Top 0.279: U5.14 1.93,17.5 1.58,17.16 v1.58,17.12 | v0.83,20.83 1.7,21.69 1.7,22.43 | 1.7,22.43 R15.2 | 1.7,22.43 1.7,35.78 0.78,36.71 0.78,39.77 2.42,41.41 9.28,41.41 9.66,41.8 9.66,41.98 v9.27,42.37 | v20.52,40.13 21.92,41.53 21.92,48.77 U3.23
  Top 0.762: U3.23 U$8.14
  Bottom 0.279: v1.58,17.12 1.42,17.28 1.18,17.28 0.83,17.63 v0.83,20.83 | v9.27,42.37 11.51,40.13 v20.52,40.13
RXLED
  Top 0.356: U2.22 28.27,15.19 29.33,14.13 D2.C
SD_CARD_IRQ  (via drill 0.35)
  Top 0.508: v25.38,120.19 25.38,112.57 24.38,111.58 24.38,101.22 v28.17,97.43 | v21.89,89.08 22.78,89.97 U3.38
  Bottom 0.508: U7.DSW2 23.78,120.19 v25.38,120.19 | v28.17,97.43 28.17,93.12 U3.38 | R20.2 21.49,89.48 v21.89,89.08
SIM_BOOT
  Top 0.508: U$7.7 7.04,59.49 7.14,59.38 7.14,49.43 U3.20
SIM_PWR_STAT
  Top 0.508: U3.19 7.8,51.31 7.8,62 7.77,62.03 U$7.8
SIM_RX
  Bottom 0.508: U3.17 U$7.5
SIM_TX
  Bottom 0.508: U$7.6 U3.16
SPI_MISO  (via drill 0.35)
  Top 0.508: 15.32,79.78 16.4,80.86 U8.17 16.4,100.58 23.72,107.9 v23.72,112.47 | 15.32,79.78 9.8,79.78 U3.7 | v16.44,54.84 16.48,54.84 16.48,45.92 16.43,45.92 10.05,39.55 9.55,39.55 U6.2 | v14.63,67.87 13.74,68.76 v13.74,71.17 | v16.31,77.75 16.31,78.79 15.32,79.78
  Bottom 0.279: JP3.1 4.61,81.04 6.35,81.04 6.37,81.03 8.56,81.03 U3.7
  Bottom 0.508: v16.44,54.84 16.44,66.06 v14.63,67.87 | v13.74,71.17 13.74,75.18 v16.31,77.75 | v23.72,112.47 23.72,114.92 U7.7
SPI_MOSI  (via drill 0.35)
  Top 0.508: U3.6 14.82,82.35 15.74,83.26 15.74,95.11 14.4,96.45 14.4,97.94 | 14.4,97.94 U8.16 14.4,99.77 22.94,108.31 22.94,113.46 21.61,114.78 v21.61,117.35 | JP4.2 8.38,82.35 U3.6 | v15.77,54.43 15.82,54.38 15.82,46.25 9.78,40.21 2.92,40.21 1.98,39.27 1.98,37.21 3.65,35.54 v3.72,35.54 | v13.99,66.83 12.85,67.97 v12.85,70.81 | v13.69,80.82 11.3,80.82 U3.6 | 14.43,97.97 14.4,97.94
  Bottom 0.508: v15.77,54.43 15.77,54.5 15.73,54.55 15.73,65.09 v13.99,66.83 | v12.85,70.81 12.85,76.66 13.69,77.5 v13.69,80.82 | U7.3 19.36,116.21 20.5,117.35 v21.61,117.35 | U6.5 3.48,35.31 v3.72,35.54
SPI_SCK  (via drill 0.35)
  Top 0.508: U3.8 11.1,78.59 v14.96,78.59 | v14.45,83.21 15.08,83.84 15.08,94.83 14.2,95.71 11.43,95.71 10.4,96.74 U8.14 10.4,101.61 v21.54,112.75 | v13.41,53.11 15.16,51.36 15.16,46.53 9.51,40.87 2.65,40.87 1.32,39.54 1.32,36.94 6.02,32.24 U6.6 | v11.81,70.81 11.81,58.04 v12.06,57.78
  Bottom 0.279: JP3.2 4.57,78.54 8.51,78.54 U3.8
  Bottom 0.508: v14.45,83.21 14.45,79.1 v14.96,78.59 | U3.8 11.81,75.23 v11.81,70.81 | v12.06,57.78 13.41,56.44 v13.41,53.11 | v21.54,112.75 21.54,114.94 U7.5
STAT1
  Top 0.279: U4.P$8 8.36,8.79 8.08,8.51 8.08,7.75 R7.1
STAT2
  Top 0.279: U4.P$7 8.37,9.29 7.87,9.78 R8.1
SYS_BAT  (via drill 0.35)
  Top 0.279: U4.P$1 12.63,11.16 12.78,11.3 13.01,11.3 14.33,9.98 14.13,9.79 U4.P$20
  Top 0.508: 14.33,9.98 14.79,10.44 v14.91,10.44 | C10.1 18.54,12.78 v18.67,12.65
  Bottom 0.508: 18.72,12.78 18.72,12.7 v18.67,12.65
  Bottom 0.762: v14.91,10.44 15.29,10.82 15.29,11.91 16.15,12.78 18.72,12.78 19.56,13.62 19.56,18.16 JP1.1
THERM
  Top 0.279: THERM.2 9.27,12.85 9.27,12.52 9.27,11.4 9.92,10.75 U4.P$5
TO_BAT
  Bottom 1.016: B1.2 16.4,37.73 17.09,38.43 22.15,38.43 24.13,36.45 30.33,36.45 SW2.1P
TO_D1
  Top 0.762: R1.1 D1.A
TO_D2
  Top 0.762: D2.A R2.1
TO_L1  (via drill 0.35)
  Top 0.279: U5.8 1.91,20.5 1.88,20.47 1.88,20.07 1.95,20 U5.9
  Top 0.508: 1.91,20.5 1.67,20.5 v1.43,20.26
  Bottom 0.508: v1.43,20.26 1.84,20.68 L2.P$1
TO_L2  (via drill 0.35)
  Top 0.279: U5.7 5.94,20.5 6.02,20.5 6.02,20.07 5.95,20 U5.6
  Top 0.508: 6.02,20.5 6.2,20.5 v6.43,20.73
  Bottom 0.508: v6.43,20.73 6.43,24.83 L2.P$2
TPS_VIN  (via drill 0.35)
  Top 0.279: 1.91,19.36 1.91,19.5 U5.10 2.42,19.51 v1.43,19.51 | 1.91,19.36 1.91,19 | 1.91,19 U5.11 | C11.1 0.67,17.19 0.67,19.51 v1.43,19.51 | 1.91,19 1.43,19.48 v1.43,19.51 | v1.43,19.51 1.58,19.36 1.91,19.36
  Bottom 0.508: v1.43,19.51 7.3,19.51 9.08,21.28 15.82,21.28 JP1.2
TXLED
  Top 0.356: U2.23 28.91,15.69 29.36,15.24 33.02,15.24 D1.C
USB_5V  (via drill 0.35)
  Top 0.762: v25.91,7.24 25.93,8.13
  Top 1.016: 26.98,8.11 L1.1 25.93,8.13 C1.1
  Bottom 0.406: U1.1 27.21,6.6 26.57,7.24 v25.91,7.24
USB_D+  (via drill 0.35)
  Top 0.356: U2.15 v23.71,14.77 v23.72,14.76
  Bottom 0.406: U1.3 25.91,5.52 24.69,6.74 24.69,13.79 v23.72,14.76
USB_D-  (via drill 0.35)
  Top 0.356: U2.16 24.36,15.26 v24.38,15.24
  Bottom 0.356: 25.28,14.22 24.98,14.52 24.38,15.11 v24.38,15.24
  Bottom 0.406: U1.2 26.56,5.66 25.25,6.97 25.25,14.25 24.98,14.52
USB_RX
  Top 0.356: U2.5 29.57,25.27 27.91,26.92 27.38,27.46 27.28,27.56 27.28,29.84 27.28,30.43 D3.+
USB_SUSPEND  (via drill 0.35)
  Top 0.279: R5.2 6.91,12.77 v6.96,12.65 | v12.95,19.63 13.21,19.89 13.21,22.47 13.82,23.09 13.82,26.75 | 28.37,28.94 R3.1
  Top 0.356: U2.14 23.71,25.99 22.38,27.33 | 13.82,26.75 14.41,27.33 22.38,27.33 | 22.38,27.33 v22.38,27.21 | R3.1 28.36,33.19 v28.37,33.2
  Top 0.508: 13.82,26.75 13.46,26.75 v13.01,27.2 | U3.22 23.32,47.62 23.32,44.42 24.43,43.31 24.46,43.31 24.51,43.26 v24.51,37.97
  Top 0.762: U3.22 U$8.15
  Bottom 0.279: v6.96,12.65 9.39,15.16 9.39,16.25 10.13,17 10.13,19.48 10.29,19.63 v12.95,19.63 | v22.38,27.21 23.47,28.3 23.47,30.58 24.41,31.52
  Bottom 0.356: v28.37,33.2 28.3,33.27 26.16,33.27 24.41,31.52
  Bottom 0.508: v13.01,27.2 13.01,29.82 12.68,30.15 12.68,36.78 15.24,39.34 22.53,39.34 23.7,38.18 24.31,38.18 v24.51,37.97
USB_TX  (via drill 0.35)
  Top 0.356: U2.1 32.16,34.13 v26.85,39.62
  Bottom 0.356: v26.85,39.62 24.22,39.62 22.01,41.66 14.55,41.66 14.55,46.56 14.55,57.25 U3.14
VBAT  (via drill 0.35)
  Top 0.279: C9.1 8.65,5.18 12.65,5.18 12.65,6.38 | 12.65,6.38 12.65,6.45 | 12.65,6.45 12.65,6.81 U4.P$15 | 12.65,6.38 12.17,6.38 12.13,6.41 U4.P$14 | U4.P$16 14.06,7.79 14.1,7.75 14.1,6.48 14.02,6.4 12.7,6.4 12.65,6.45
  Top 0.762: 14.1,6.48 14.33,6.25
  Top 1.016: 14.33,6.25 14.33,5 v14.35,4.98 | v15.75,3.96 20.6,3.96 v21.06,4.39 | v20.68,22.89 22.63,24.84 v22.63,25.43
  Bottom 1.016: v14.35,4.98 15.37,3.96 v15.75,3.96 | v21.06,4.39 21.06,11.99 20.6,12.45 20.6,22.81 v20.68,22.89 | v22.63,25.43 24.28,27.08 24.28,30.12 SW2.2T 30.94,30.12 30.99,30.18
VPCC
  Top 0.279: U4.P$2 12.13,11.97 R10.2
  Top 1.016: R9.1 R10.2
XB_DIN  (via drill 0.35)
  Top 0.508: U3.4 3.3,87.43 1.45,89.28 1.45,112.52 v1.5,112.52 | v4.24,118.67 6.64,118.67 U8.4
  Bottom 0.508: v4.24,118.67 3.7,118.67 1.45,116.41 1.45,112.57 v1.5,112.52
XB_DOUT  (via drill 0.35)
  Top 0.508: U8.3 4.78,120.68 v4.34,120.24 | U3.5 4.9,84.89 0.79,89 0.79,116.9 v0.88,116.99
  Bottom 0.508: v0.88,116.99 1.09,116.99 v4.34,120.24
XB_RSSI  (via drill 0.35)
  Top 0.508: U8.7 10.76,112.68 v11.2,112.24 | v20.34,93.6 21.36,92.51 U3.39
  Bottom 0.508: v11.2,112.24 10.95,111.99 10.95,101.55 14.53,97.97 14.53,93.57 18.23,93.57 18.26,93.57 20.32,93.57 v20.34,93.6
XB_SLEEP
  Top 0.508: U3.2 4.29,92.51 2.77,94.03 2.77,105.23 4.22,106.68 U8.10
XB_WAKE_HOST_IRQ
  Top 0.508: U8.26 30.86,108.68 30.91,108.64 30.91,97.28 29.69,96.06 28.73,95.1 28.68,95.05 U3.40
XTAL1
  Top 1.016: C5.2 4.22,63.79 XTAL.2 9,63.79 U3.13
XTAL2
  Top 1.016: C6.2 4.14,67.89 XTAL.1 9,67.89 U3.12

### Text on the board
tNames: C19 | C18 | C17 | R21
_tsilk: R19 | ICSP | C7 | C8 | RESET | TELEMETRY BOARD REV 0.1 / HARLAN J WALDROP / ABOYANDHISGNU.ORG/PROJECTS / 2017-12-30 | R4 | C6 | 16.000 | C5 | GSM / GPS | EEPROM | R3 | C14 | C13 | R15 | L2 | Q1 | U2 | FTDI | R9 | C10 | D2 | D1 | C3 | RX | TX | C11 | C12 | R5 | RTH | R6 | R10 | C4 | C2 | DONE | D5 | R8 | CHG | USB / AC-DC | USB / CHG EN | D4 | R7 | C1 | L1 | R2 | R1 | R14 | R13 | C9 | R12 | R11 | HARLAN WALDROP 0.1 / ABOYANDHISGNU.ORG
_bsilk: C16 | R20 | R22 | R16 | R17 | D3 | R18 | C15